# EAGLE design control_FET (EAGLE 6.5.0)
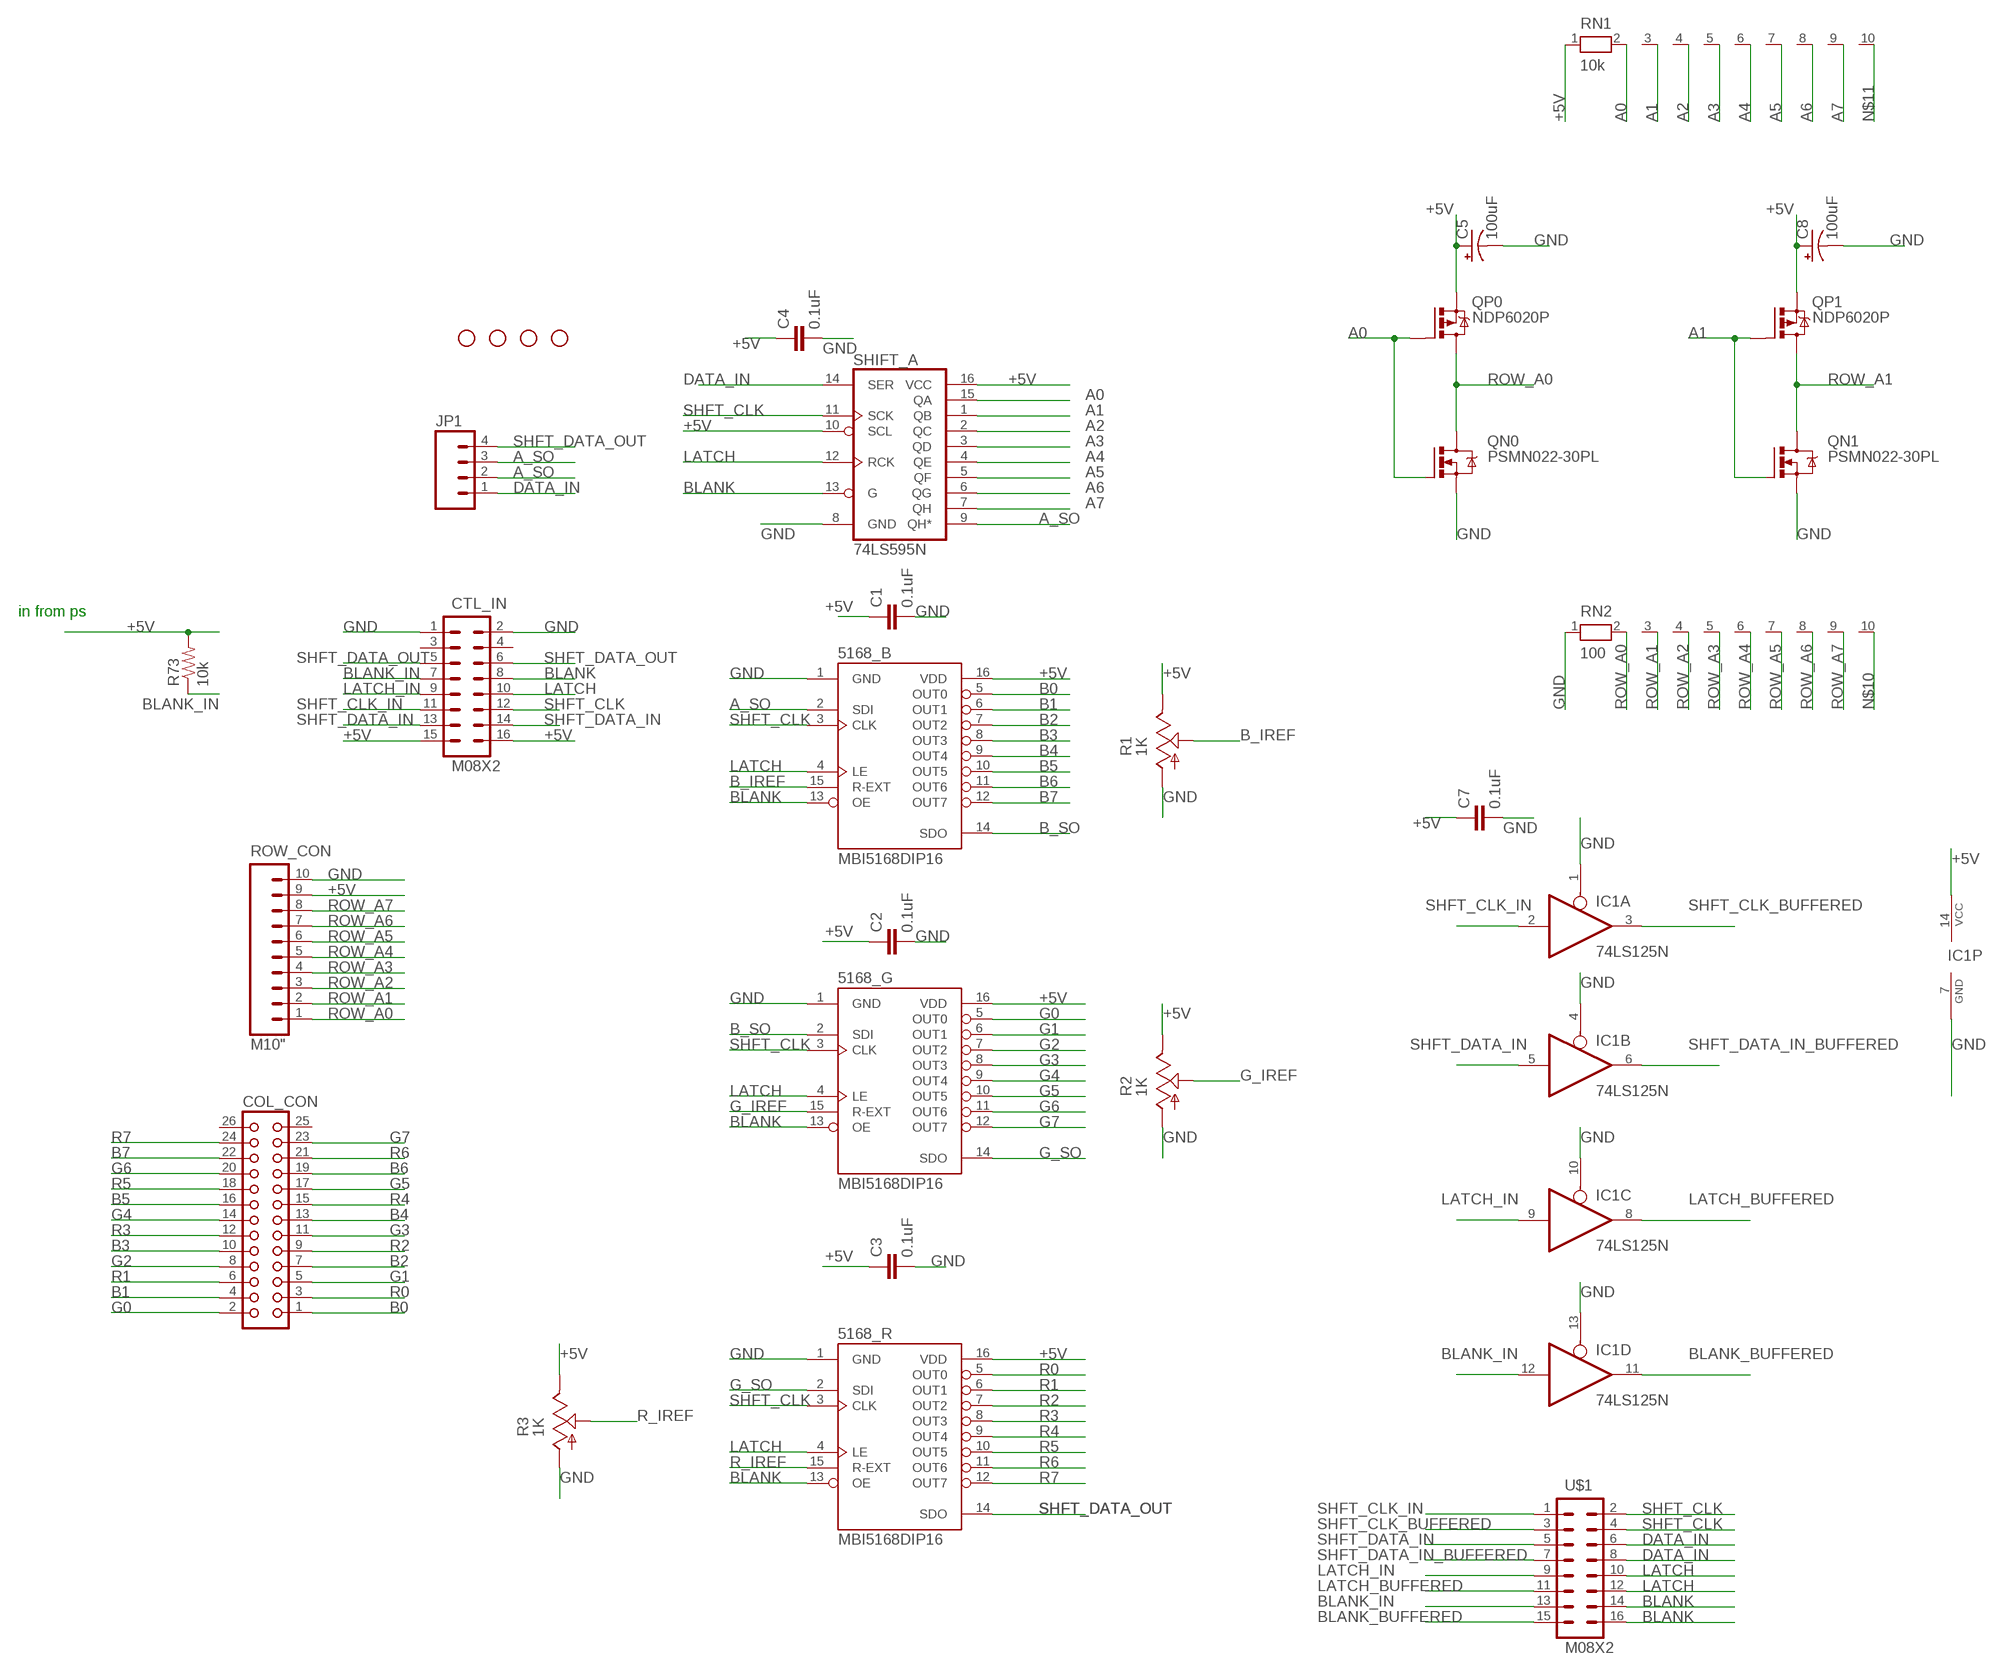
[diagram p0: schematic, sheet 1, part 1 of 2]
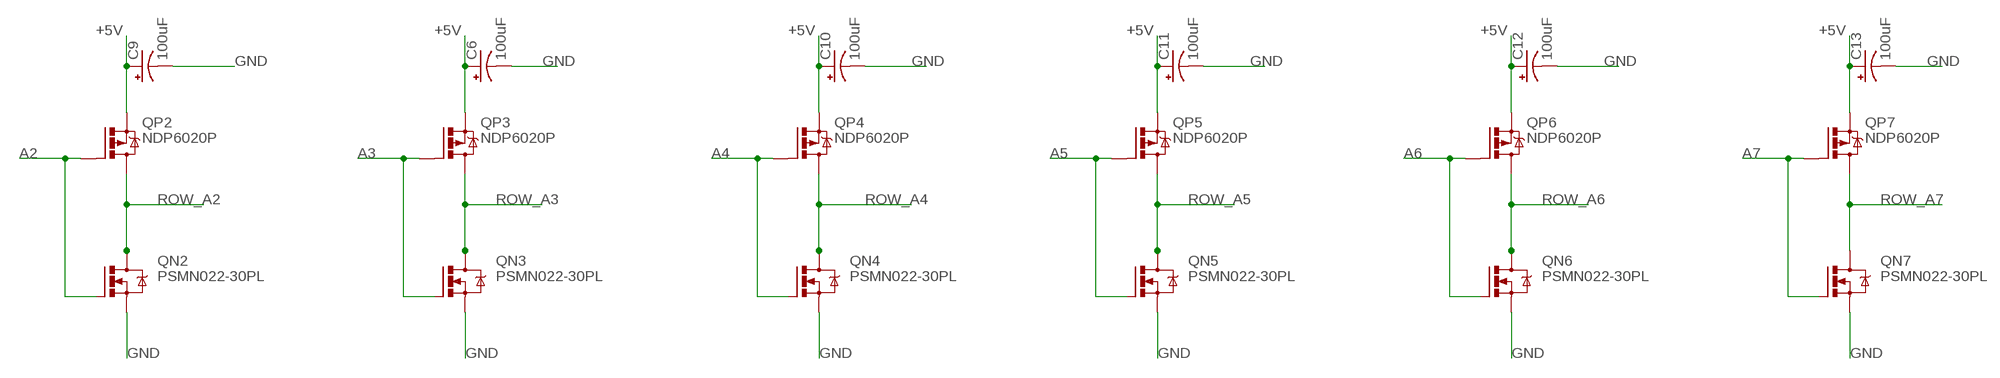
[diagram p1: schematic, sheet 1, part 2 of 2]

## Parts
5168_B  MBI5168DIP16  [DIL16]
5168_G  MBI5168DIP16  [DIL16]
5168_R  MBI5168DIP16  [DIL16]
C1  0.1uF  C2,5-3  [C2.5-3]
C2  0.1uF  C2,5-3  [C2.5-3]
C3  0.1uF  C2,5-3  [C2.5-3]
C4  0.1uF  C2,5-3  [C2.5-3]
C5  100uF  CAP_POLPTH1  [CPOL-RADIAL-100UF-25V]
C6  100uF  CAP_POLPTH1  [CPOL-RADIAL-100UF-25V]
C7  0.1uF  C2,5-3  [C2.5-3]
C8  100uF  CAP_POLPTH1  [CPOL-RADIAL-100UF-25V]
C9  100uF  CAP_POLPTH1  [CPOL-RADIAL-100UF-25V]
C10  100uF  CAP_POLPTH1  [CPOL-RADIAL-100UF-25V]
C11  100uF  CAP_POLPTH1  [CPOL-RADIAL-100UF-25V]
C12  100uF  CAP_POLPTH1  [CPOL-RADIAL-100UF-25V]
C13  100uF  CAP_POLPTH1  [CPOL-RADIAL-100UF-25V]
COL_CON  CON26  [CON26]
CTL_IN  M08X2  [2X8]
IC1  74LS125N  [DIL14]
JP1  M04PTH  [1X04]
QN0  PSMN022-30PL  IRF520  [TO220BV]
QN1  PSMN022-30PL  IRF520  [TO220BV]
QN2  PSMN022-30PL  IRF520  [TO220BV]
QN3  PSMN022-30PL  IRF520  [TO220BV]
QN4  PSMN022-30PL  IRF520  [TO220BV]
QN5  PSMN022-30PL  IRF520  [TO220BV]
QN6  PSMN022-30PL  IRF520  [TO220BV]
QN7  PSMN022-30PL  IRF520  [TO220BV]
QP0  NDP6020P  IRF9530  [TO220BV]
QP1  NDP6020P  IRF9530  [TO220BV]
QP2  NDP6020P  IRF9530  [TO220BV]
QP3  NDP6020P  IRF9530  [TO220BV]
QP4  NDP6020P  IRF9530  [TO220BV]
QP5  NDP6020P  IRF9530  [TO220BV]
QP6  NDP6020P  IRF9530  [TO220BV]
QP7  NDP6020P  IRF9530  [TO220BV]
R1  1K  TRIM_US-CA6V  [CA6V]
R2  1K  TRIM_US-CA6V  [CA6V]
R3  1K  TRIM_US-CA6V  [CA6V]
R73  10k  R-US_0207/10  [0207/10]
RN1  10k  RN09  [RN-10]
RN2  100  RN09  [RN-10]
ROW_CON  M10"  [1X10]
SHIFT_A  74LS595N  [DIL16]
STANDOFF1  STAND-OFF  [STAND-OFF]
STANDOFF2  STAND-OFF  [STAND-OFF]
STANDOFF3  STAND-OFF  [STAND-OFF]
STANDOFF4  STAND-OFF  [STAND-OFF]
U$1  M08X2  [2X8]

## Nets
+5V [pwr_gnd]: 5168_B.16(VDD) 5168_G.16(VDD) 5168_R.16(VDD) C1.1 C2.1 C3.1 C4.1 C5.1(+) C6.1(+) C7.1 C8.1(+) C9.1(+) C10.1(+) C11.1(+) C12.1(+) C13.1(+) CTL_IN.15 CTL_IN.16 IC1.14(P:VCC) QP0.S QP1.S QP2.S QP3.S QP4.S QP5.S QP6.S QP7.S R1.E R2.E R3.E R73.2 RN1.1 ROW_CON.9 SHIFT_A.10(SCL) SHIFT_A.16(VCC)
A0: QN0.G QP0.G RN1.2 SHIFT_A.15(QA)
A1: QN1.G QP1.G RN1.3 SHIFT_A.1(QB)
A2: QN2.G QP2.G RN1.4 SHIFT_A.2(QC)
A3: QN3.G QP3.G RN1.5 SHIFT_A.3(QD)
A4: QN4.G QP4.G RN1.6 SHIFT_A.4(QE)
A5: QN5.G QP5.G RN1.7 SHIFT_A.5(QF)
A6: QN6.G QP6.G RN1.8 SHIFT_A.6(QG)
A7: QN7.G QP7.G RN1.9 SHIFT_A.7(QH)
A_SO: 5168_B.2(SDI) JP1.2 JP1.3 SHIFT_A.9(QH*)
B0: 5168_B.5(OUT0) COL_CON.1
B1: 5168_B.6(OUT1) COL_CON.4
B2: 5168_B.7(OUT2) COL_CON.7
B3: 5168_B.8(OUT3) COL_CON.10
B4: 5168_B.9(OUT4) COL_CON.13
B5: 5168_B.10(OUT5) COL_CON.16
B6: 5168_B.11(OUT6) COL_CON.19
B7: 5168_B.12(OUT7) COL_CON.22
B_IREF: 5168_B.15(R-EXT) R1.S
B_SO: 5168_B.14(SDO) 5168_G.2(SDI)
BLANK: 5168_B.13(OE) 5168_G.13(OE) 5168_R.13(OE) CTL_IN.8 SHIFT_A.13(G) U$1.14 U$1.16
BLANK_BUFFERED: IC1.11(D:O) U$1.15
BLANK_IN: CTL_IN.7 IC1.12(D:I) R73.1 U$1.13
DATA_IN: JP1.1 SHIFT_A.14(SER) U$1.6 U$1.8
G0: 5168_G.5(OUT0) COL_CON.2
G1: 5168_G.6(OUT1) COL_CON.5
G2: 5168_G.7(OUT2) COL_CON.8
G3: 5168_G.8(OUT3) COL_CON.11
G4: 5168_G.9(OUT4) COL_CON.14
G5: 5168_G.10(OUT5) COL_CON.17
G6: 5168_G.11(OUT6) COL_CON.20
G7: 5168_G.12(OUT7) COL_CON.23
G_IREF: 5168_G.15(R-EXT) R2.S
G_SO: 5168_G.14(SDO) 5168_R.2(SDI)
GND [pwr_gnd]: 5168_B.1(GND) 5168_G.1(GND) 5168_R.1(GND) C1.2 C2.2 C3.2 C4.2 C5.2(-) C6.2(-) C7.2 C8.2(-) C9.2(-) C10.2(-) C11.2(-) C12.2(-) C13.2(-) CTL_IN.1 CTL_IN.2 IC1.1(A:OE) IC1.4(B:OE) IC1.7(P:GND) IC1.10(C:OE) IC1.13(D:OE) QN0.S QN1.S QN2.S QN3.S QN4.S QN5.S QN6.S QN7.S R1.A R2.A R3.A RN2.1 ROW_CON.10 SHIFT_A.8(GND)
LATCH: 5168_B.4(LE) 5168_G.4(LE) 5168_R.4(LE) CTL_IN.10 SHIFT_A.12(RCK) U$1.10 U$1.12
LATCH_BUFFERED: IC1.8(C:O) U$1.11
LATCH_IN: CTL_IN.9 IC1.9(C:I) U$1.9
N$10: RN2.10
N$11: RN1.10
R0: 5168_R.5(OUT0) COL_CON.3
R1: 5168_R.6(OUT1) COL_CON.6
R2: 5168_R.7(OUT2) COL_CON.9
R3: 5168_R.8(OUT3) COL_CON.12
R4: 5168_R.9(OUT4) COL_CON.15
R5: 5168_R.10(OUT5) COL_CON.18
R6: 5168_R.11(OUT6) COL_CON.21
R7: 5168_R.12(OUT7) COL_CON.24
R_IREF: 5168_R.15(R-EXT) R3.S
ROW_A0 [pwr_gnd]: QN0.D QP0.D RN2.2 ROW_CON.1
ROW_A1 [pwr_gnd]: QN1.D QP1.D RN2.3 ROW_CON.2
ROW_A2 [pwr_gnd]: QN2.D QP2.D RN2.4 ROW_CON.3
ROW_A3 [pwr_gnd]: QN3.D QP3.D RN2.5 ROW_CON.4
ROW_A4 [pwr_gnd]: QN4.D QP4.D RN2.6 ROW_CON.5
ROW_A5 [pwr_gnd]: QN5.D QP5.D RN2.7 ROW_CON.6
ROW_A6 [pwr_gnd]: QN6.D QP6.D RN2.8 ROW_CON.7
ROW_A7 [pwr_gnd]: QN7.D QP7.D RN2.9 ROW_CON.8
SHFT_CLK: 5168_B.3(CLK) 5168_G.3(CLK) 5168_R.3(CLK) CTL_IN.12 SHIFT_A.11(SCK) U$1.2 U$1.4
SHFT_CLK_BUFFERED: IC1.3(A:O) U$1.3
SHFT_CLK_IN: CTL_IN.11 IC1.2(A:I) U$1.1
SHFT_DATA_IN: CTL_IN.13 CTL_IN.14 IC1.5(B:I) U$1.5
SHFT_DATA_IN_BUFFERED: IC1.6(B:O) U$1.7
SHFT_DATA_OUT: 5168_R.14(SDO) CTL_IN.5 CTL_IN.6 JP1.4
Unconnected: COL_CON.25 COL_CON.26 CTL_IN.3 CTL_IN.4

## Notes on the sheet
- in from ps

## Library data of the parts
5168_B 5168_G 5168_R = MBI:MBI5168: MBI5168 8-bit constant current LED sink driver
C1-C4 C7 = capacitor-wima:C: CAPACITOR naming: grid - package width
C5 C6 C8-C13 = SparkFun-Capacitors:CAP_POL: Capacitor Polarized These are standard SMD and PTH capacitors. Normally 10uF, 47uF, and 100uF in electrolytic and tantalum varieties. Always verify the external diameter of the through hole cap, it varies with capacity, voltage, and manufacturer. The EIA devices should be standard.
COL_CON = con-harting:CON26: CONNECTOR; OC_FARNELL: unknown; OC_NEWARK: unknown
CTL_IN U$1 = SparkFun-Connectors:M08X2: .1" headers, two rows of 8 each
IC1 = 74xx-us:74*125: Quad bus BUFFER, 3-state
JP1 = SparkFun-Connectors:M04: Header 4 Standard 4-pin 0.1" header. Use with straight break away headers (SKU : PRT-00116), right angle break away headers (PRT-00553), swiss pins (PRT-00743), machine pins (PRT-00117), and female headers (PRT-00115). Molex polarized connector foot print use with SKU : PRT-08231 with associated crimp pins and housings. 1MM SMD Version SKU: PRT-10208
QN0 QN1-QN7 = transistor-power:IRF520: HEXFET Power MOSFET
QP0 QP1-QP7 = transistor-power:IRF9530: P-CHANNEL HEXFET POWER-MOS-FET Source: http://www.irf.com/product-info/datasheets/data/irf9530.pdf
R1-R3 = pot:TRIM_US-: POTENTIOMETER
R73 = resistor:R-US_: RESISTOR, American symbol
RN1 RN2 = resistor-net:RN09: RESISTOR NETWORK; OC_FARNELL: unknown; OC_NEWARK: unknown
ROW_CON = SparkFun-Connectors:M10: Header 10 Standard 10-pin 0.1" header. Use with straight break away headers (SKU : PRT-00116), right angle break away headers (PRT-00553), swiss pins (PRT-00743), machine pins (PRT-00117), and female headers (PRT-00115).
SHIFT_A = SparkFun-DigitalIC:74*595: 8-bit SHIFT REGISTER, output latch
STANDOFF1-STANDOFF4 = SparkFun-Electromechanical:STAND-OFF: #4 Stand Off This is the mechanical footprint for a #4 phillips button head screw. Use the keepout ring to avoid running the screw head into surrounding components. SKU : PRT-00447

## Net classes
1 pwr_gnd: width 0.813 mm

## Board
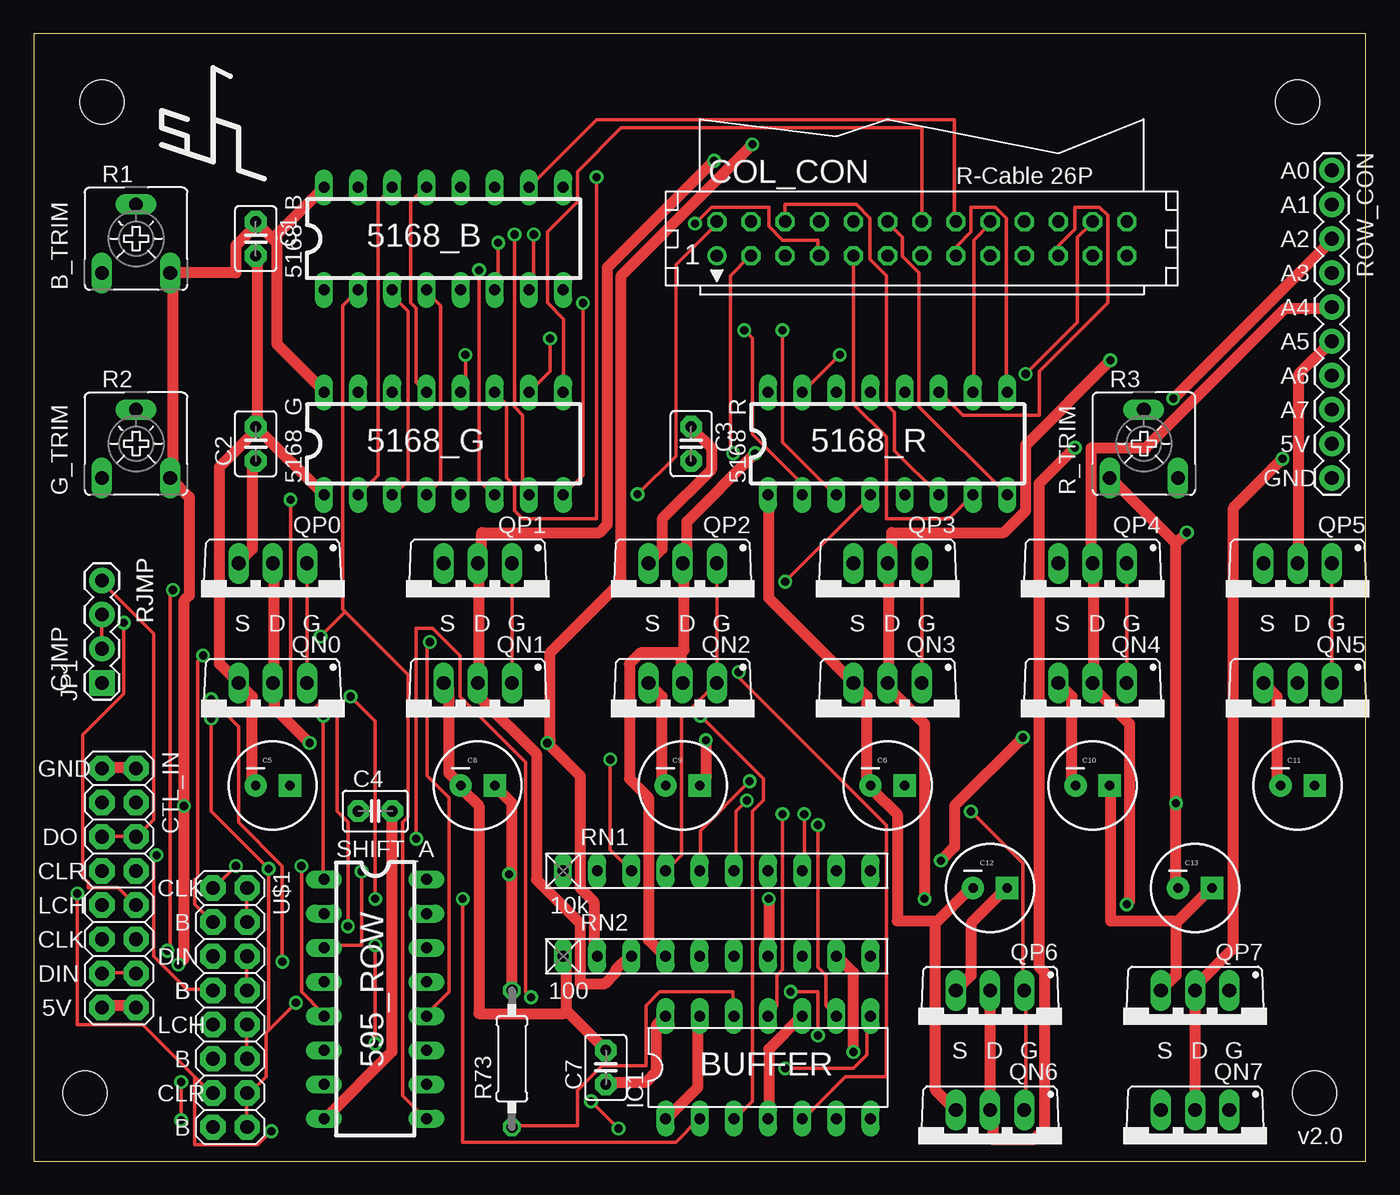
[diagram p2: board, top side]
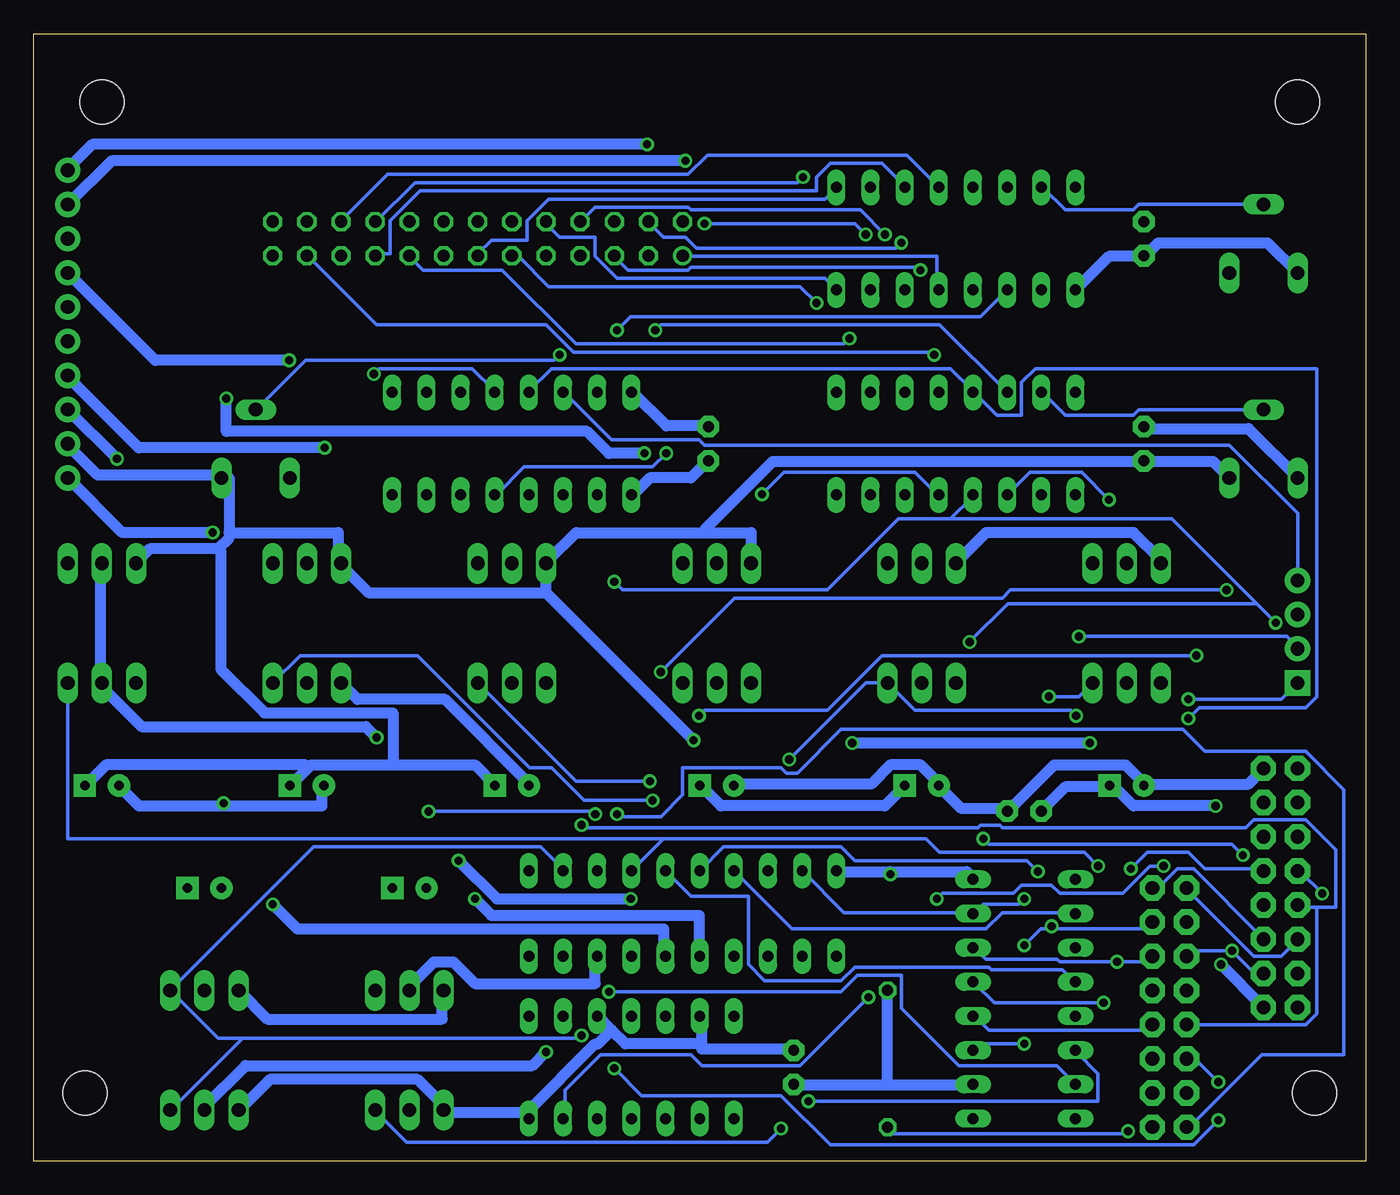
[diagram p3: board, bottom side, seen from below]

Size 99.06 x 83.82 mm. Coordinates in mm from the lower left corner, seen from the top.
Outline: 0,0 99.06,0 99.06,83.82 0,83.82 0,0
Copper layers (1*16): Top 0.035mm / dielectric 1.5mm / Bottom 0.035mm
Design rules "default": minimum track width 10mil, minimum drill 24mil, track to track 8mil, track to pad 8mil, pad to pad 8mil, via to via 8mil, smd to smd 8mil, copper to edge 40mil, drill to drill 8mil, minimum pad ring 10mil, minimum via ring 8mil, stop-mask expansion 4mil, vias tented up to drill 0mil, thermal gap 10mil

### Footprints (pad centres in the part's own frame; a part is rotated, then mirrored left to right if it is on the bottom)
DIL16 = drill 0.813 long: 1 -8.89,-3.81; 2 -6.35,-3.81; 3 -3.81,-3.81; 4 -1.27,-3.81; 5 1.27,-3.81; 6 3.81,-3.81; 7 6.35,-3.81; 8 8.89,-3.81; 9 8.89,3.81; 10 6.35,3.81; 11 3.81,3.81; 12 1.27,3.81; 13 -1.27,3.81; 14 -3.81,3.81; 15 -6.35,3.81; 16 -8.89,3.81
C2.5-3 = drill 0.813 pad 1.6 octagon: 1 -1.27,0; 2 1.27,0
CPOL-RADIAL-100UF-25V = drill 0.7 pad 1.651 square: 1 1.27,0 | drill 0.7 pad 1.651: 2 -1.27,0
CON26 = drill 0.914: 1 -15.24,-1.27 | drill 0.914 octagon: 2 -15.24,1.27; 3 -12.7,-1.27; 4 -12.7,1.27; 5 -10.16,-1.27; 6 -10.16,1.27; 7 -7.62,-1.27; 8 -7.62,1.27; 9 -5.08,-1.27; 10 -5.08,1.27; 11 -2.54,-1.27; 12 -2.54,1.27; 13 0,-1.27; 14 0,1.27; 15 2.54,-1.27; 16 2.54,1.27; 17 5.08,-1.27; 18 5.08,1.27; 19 7.62,-1.27; 20 7.62,1.27; 21 10.16,-1.27; 22 10.16,1.27; 23 12.7,-1.27; 24 12.7,1.27; 25 15.24,-1.27; 26 15.24,1.27
2X8 = drill 1.016 pad 1.88 octagon: 1 0,0; 2 0,2.54; 3 2.54,0; 4 2.54,2.54; 5 5.08,0; 6 5.08,2.54; 7 7.62,0; 8 7.62,2.54; 9 10.16,0; 10 10.16,2.54; 11 12.7,0; 12 12.7,2.54; 13 15.24,0; 14 15.24,2.54; 15 17.78,0; 16 17.78,2.54
DIL14 = drill 0.813 long: 1 -7.62,-3.81; 2 -5.08,-3.81; 3 -2.54,-3.81; 4 0,-3.81; 5 2.54,-3.81; 6 5.08,-3.81; 7 7.62,-3.81; 8 7.62,3.81; 9 5.08,3.81; 10 2.54,3.81; 11 0,3.81; 12 -2.54,3.81; 13 -5.08,3.81; 14 -7.62,3.81
1X04 = drill 1.016 pad 1.88 square: 1 0,0 | drill 1.016 pad 1.88: 2 2.54,0; 3 5.08,0; 4 7.62,0
TO220BV = drill 1.016 long: D 0,-2.54; G -2.54,-2.54; S 2.54,-2.54
CA6V = drill 1.016 long: A -2.54,-2.54; E 2.54,-2.54; S 0,2.54
0207/10 = drill 0.813 octagon: 1 -5.08,0; 2 5.08,0
RN-10 = drill 0.813 long: 1 -11.43,0; 2 -8.89,0; 3 -6.35,0; 4 -3.81,0; 5 -1.27,0; 6 1.27,0; 7 3.81,0; 8 6.35,0; 9 8.89,0; 10 11.43,0
1X10 = drill 1.016 pad 1.88: 1 0,0; 2 2.54,0; 3 5.08,0; 4 7.62,0; 5 10.16,0; 6 12.7,0; 7 15.24,0; 8 17.78,0; 9 20.32,0; 10 22.86,0
STAND-OFF = hole 3.302: 0,0

### Placement (x,y rotation side)
5168_B  30.48,68.58 0 top
5168_G  30.48,53.34 0 top
5168_R  63.5,53.34 0 top
C1  16.51,68.58 270 top
C2  16.51,53.34 90 top
C3  48.9,53.34 270 top
C4  25.4,26.04 0 top
C5  17.78,27.94 0 top
C6  63.5,27.94 0 top
C7  42.55,6.99 90 top
C8  33.02,27.94 0 top
C9  48.26,27.94 0 top
C10  78.74,27.94 0 top
C11  93.98,27.94 0 top
C12  71.12,20.32 0 top
C13  86.36,20.32 0 top
COL_CON  66.04,68.58 0 top
CTL_IN  5.08,29.21 270 top
IC1  54.61,6.99 0 top
JP1  5.08,35.56 90 top
QN0  17.78,33.02 180 top
QN1  33.02,33.02 180 top
QN2  48.26,33.02 180 top
QN3  63.5,33.02 180 top
QN4  78.74,33.02 180 top
QN5  93.98,33.02 180 top
QN6  71.12,1.27 180 top
QN7  86.36,1.27 180 top
QP0  17.78,41.91 180 top
QP1  33.02,41.91 180 top
QP2  48.26,41.91 180 top
QP3  63.5,41.91 180 top
QP4  78.74,41.91 180 top
QP5  93.98,41.91 180 top
QP6  71.12,10.16 180 top
QP7  86.36,10.16 180 top
R1  7.62,68.58 0 top
R2  7.62,53.34 0 top
R3  82.55,53.34 0 top
R73  35.56,7.62 90 top
RN1  50.8,21.59 0 top
RN2  50.8,15.24 0 top
ROW_CON  96.52,73.66 270 top
SHIFT_A  25.4,12.06 270 top
STANDOFF1  95.25,5.08 0 top
STANDOFF2  93.98,78.74 0 top
STANDOFF3  3.81,5.08 0 top
STANDOFF4  5.08,78.74 0 top
U$1  13.34,20.32 270 top

### Tracks (layer width: path | path; a pad name or v marks a point on that pad's centre or on a via)
+5V  (via drill 0.61)
  Top 0.813: 17.88,68.48 C1.1 16.46,69.49 15.04,68.07 15.04,66.04 R1.E 10.36,65.84 10.36,51 R2.E 11.58,49.38 11.58,42.06 11.18,41.66 v11.18,26.42 11.18,15.04 v10.77,14.63 | 17.88,68.48 18.09,68.28 18.09,60.76 21.54,57.3 5168_G.16 | 5168_B.16 18.09,68.89 18.09,68.68 17.88,68.48 | CTL_IN.15 5.08,11.58 7.52,11.58 CTL_IN.16 | C2.1 16.26,51.82 16.26,45.52 15.24,44.5 QP0.S | QP6.S 69.7,13.82 69.7,17.68 72.34,20.32 C12.1 | QP7.S 84.94,13.82 84.94,17.68 | 84.94,17.68 87.58,20.32 C13.1 | 84.94,17.68 84.73,17.88 80.06,17.88 80.06,27.84 C10.1 | IC1.14 46.94,10.77 46.33,10.16 46.33,6.71 45.52,5.89 42.67,5.89 C7.1 | R73.2 35.56,21.34 | 35.56,21.34 35.56,26.62 34.34,27.84 C8.1 | v35.36,21.34 35.56,21.34 | QP2.S 45.72,44.5 46.74,45.52 46.74,47.75 50.39,51.41 50.39,53.03 48.97,54.46 C3.1 | v49.99,31.29 49.99,28.45 49.58,28.04 C9.1
  Bottom 0.813: C4.1 23.98,26.21 22.35,27.84 19.1,27.84 C5.1 18.69,27.84 17.27,26.42 v11.18,26.42 | QP0.S 15.24,44.7 17.27,46.74 28.25,46.74 30.48,44.5 QP1.S | R2.E 11.38,52.02 16.46,52.02 C2.1 16.87,52.02 44.09,52.02 49.17,46.94 49.17,46.74 | v10.77,14.63 7.72,11.58 CTL_IN.16 | QP7.S 81.69,10.57 68.68,10.57 68.68,12.6 QP6.S | 72.34,29.46 78.44,29.46 78.64,29.26 | 72.34,29.46 66.24,29.46 64.82,28.04 C6.1 | 78.64,29.26 79.86,28.04 C10.1 | C11.1 95.1,28.04 93.67,29.46 78.84,29.46 78.64,29.26 | 35.36,21.54 39.22,21.54 RN1.1 | 35.36,21.54 29.67,21.54 29.26,21.13 SHIFT_A.16 | 35.56,5.69 42.47,5.69 C7.1 | 35.56,5.69 29.26,5.69 SHIFT_A.10 | 35.56,5.69 R73.2 | C9.1 49.38,27.84 47.95,26.42 35.76,26.42 34.34,27.84 C8.1 | v35.36,21.34 35.36,21.54 | 5168_R.16 54.46,57.1 52.02,54.66 48.97,54.66 C3.1 | 60.96,42.27 QP3.S 60.76,44.7 58.73,46.74 49.17,46.74 | 60.96,42.27 74.17,42.27 76.2,44.3 QP4.S 76.4,44.7 76.4,46.74 84.53,46.74 | 85.34,45.52 90.42,45.52 91.44,44.5 QP5.S | 85.34,45.52 84.53,46.33 84.53,46.74 | 84.53,46.74 84.53,50.8 R3.E 85.34,51 94.28,51 96.52,53.24 ROW_CON.9 | QP2.S 45.72,46.74 49.17,46.74 | 60.96,42.27 v49.99,31.29 | 72.34,29.46 72.34,33.33 81.89,33.33 85.14,36.58 85.14,45.31 85.34,45.52
A0  (via drill 0.61)
  Top 0.254: QP0.G QN0.G | v23.57,34.54 25.4,32.72 v25.4,19.51
  Bottom 0.254: RN1.2 38.81,18.49 29.26,18.49 SHIFT_A.15 29.06,18.49 28.45,19.1 25.81,19.1 v25.4,19.51 | QN0.G 21.34,34.54 v23.57,34.54
A1  (via drill 0.61)
  Top 0.254: v21.54,33.12 21.54,21.13 SHIFT_A.1 | RN1.3 42.88,23.16 v42.88,29.87 | QN1.G QP1.G
  Bottom 0.254: v21.54,33.12 21.95,33.53 33.53,33.53 QN1.G 37.19,35.56 v42.88,29.87
A2
  Top 0.254: QP2.G QN2.G 48.16,32.92 48.16,22.76 RN1.4
  Bottom 0.254: RN1.4 42.67,17.27 28.25,17.27 27.03,18.49 21.74,18.49 SHIFT_A.2
A3  (via drill 0.61)
  Top 0.254: QP3.G QN3.G | v24.38,21.54 24.38,16.05 21.74,16.05 SHIFT_A.3 | v53.24,28.25 49.58,24.59 49.58,21.74 RN1.5
  Bottom 0.254: v24.38,21.54 25.2,22.35 38,22.35 39.01,23.37 47.75,23.37 RN1.5 | QN3.G 58.73,28.25 v53.24,28.25
A4  (via drill 0.61)
  Top 0.254: QP4.G QN4.G | v53.03,26.82 52.22,26.01 52.22,21.74 RN1.6
  Bottom 0.254: RN1.6 50.19,19.71 45.92,19.71 45.92,14.63 44.7,13.41 39.01,13.41 38,14.43 28.04,14.43 27.84,14.22 22.55,14.22 21.74,13.41 SHIFT_A.4 | QN4.G 79.25,37.59 70.51,37.59 62.18,29.26 60.55,29.26 58.12,26.82 v53.03,26.82
A5  (via drill 0.61)
  Top 0.254: QP5.G QN5.G | v19.91,21.95 19.91,12.6 21.54,10.97 SHIFT_A.5
  Bottom 0.254: v19.91,21.95 20.93,22.96 31.7,22.96 32.72,23.98 52.22,23.98 | RN1.7 52.22,23.98 | QN5.G 96.52,23.98 52.22,23.98
A6  (via drill 0.61)
  Top 0.254: v57.3,25.81 57.3,21.74 RN1.8 | v69.7,26.01 73.56,22.15 73.56,12.8 QP6.G 73.76,12.6 73.76,3.86 QN6.G | v43.48,2.44 v41.45,4.47
  Bottom 0.254: v57.3,25.81 57.51,26.01 v69.7,26.01 | v41.45,4.47 19.91,4.47 19.91,6.5 21.54,8.13 SHIFT_A.6 | v43.48,2.44 44.5,1.42 71.32,1.42 73.56,3.66 QN6.G
A7  (via drill 0.61)
  Top 0.254: v56.29,12.6 58.32,12.6 v58.32,9.35
  Bottom 0.254: v56.29,12.6 39.01,12.6 37.8,13.82 34.54,13.82 34.54,11.38 30.28,7.11 22.96,7.11 21.74,5.89 SHIFT_A.7 | v58.32,9.35 58.52,9.14 83.52,9.14 | 83.52,9.14 85.34,9.14 QP7.G 78.23,23.37 61.37,23.37 59.74,21.74 RN1.9 | 83.52,9.14 88.8,3.86 QN7.G
A_SO  (via drill 0.61)
  Top 0.254: JP1.3 JP1.2 | 23.16,40.84 22.96,41.05 22.96,63.6 5168_B.2 | 23.16,40.84 27.84,36.17 27.84,25.6 27.43,25.2 27.43,4.88 29.06,3.25 SHIFT_A.9 | 23.16,40.84 v21.34,39.01
  Bottom 0.254: v21.34,39.01 5.89,39.01 5.08,38.2 JP1.2
B0
  Bottom 0.254: 5168_B.5 31.9,64.82 31.9,67.26 50.8,67.26 COL_CON.1
B1  (via drill 0.61)
  Top 0.254: 5168_B.6 34.54,65.02 v34.54,68.28
  Bottom 0.254: v34.54,68.28 34.95,67.87 49.78,67.87 50.6,68.68 52.22,68.68 53.24,69.7 COL_CON.4
B2  (via drill 0.61)
  Top 0.254: v37.19,68.89 37.19,65.02 36.98,64.82 5168_B.7 | v49.17,69.7 50.39,70.92 54.66,70.92 54.66,69.49 55.68,68.48 58.32,68.48 58.32,67.46 COL_CON.7
  Bottom 0.254: v37.19,68.89 38,69.7 v49.17,69.7
B3
  Bottom 0.254: 5168_B.8 40.23,65.63 55.68,65.63 57.3,67.26 57.3,68.68 59.94,68.68 60.96,69.7 COL_CON.10
B4
  Bottom 0.254: 5168_B.9 40.23,71.53 60.76,71.53 62.38,69.9 62.38,68.48 65.02,68.48 66.04,67.46 COL_CON.13
B5
  Top 0.254: 5168_B.10 41.86,77.42 68.48,77.42 68.48,69.9 COL_CON.16
B6
  Bottom 0.254: 5168_B.11 34.34,72.54 35.97,74.17 39.83,74.17 40.84,73.15 40.84,72.14 70.31,72.14 72.54,69.9 72.54,67.46 73.56,67.46 COL_CON.19
B7
  Bottom 0.254: 5168_B.12 34.14,74.78 48.97,74.78 50.39,73.36 72.75,73.36 76.2,69.9 COL_CON.22
B_IREF
  Bottom 0.254: R1.S 16.87,71.12 17.27,70.71 22.35,70.71 23.98,72.34 5168_B.15
B_SO
  Top 0.254: 5168_G.2 25.6,51 25.6,71.32 5168_B.14
BLANK  (via drill 0.61)
  Top 0.254: 17.48,9.75 17.27,9.55 17.27,6.3 16.05,5.08 U$1.14 15.85,5.08 15.85,2.64 U$1.16 | 17.48,9.75 v19.51,11.79 | 17.48,9.75 v17.48,21.74 13.21,26.01 v13.21,32.92 | 5168_G.13 28.45,57.91 28.45,63.4 28.04,63.8 28.04,71.32 29.06,72.34 5168_B.13
  Bottom 0.254: v19.51,11.79 27.64,11.79 29.06,13.21 SHIFT_A.13 | v17.48,21.74 16.26,22.96 13.21,22.96 11.99,21.74 7.72,21.74 CTL_IN.8 | 5168_R.13 62.18,57.3 60.55,58.93 30.89,58.93 29.26,57.3 5168_G.13 29.06,57.1 27.43,55.47 25.6,55.47 25.6,57.91 24.59,58.93 3.66,58.93 3.66,34.54 4.47,33.73 12.39,33.73 v13.21,32.92
BLANK_BUFFERED  (via drill 0.61)
  Top 0.254: v55.68,25.81 55.68,14.22 55.27,13.82 55.27,11.58 54.66,10.97 IC1.11
  Bottom 0.254: v55.68,25.81 55.47,25.6 52.43,25.6 50.8,27.23 50.8,29.26 43.48,29.26 43.08,28.85 42.27,28.85 39.01,32.11 13.61,32.11 11.99,30.48 4.47,30.48 1.63,27.64 1.63,7.92 7.72,7.92 13.01,2.64 13.21,2.64 U$1.15
BLANK_IN  (via drill 0.61)
  Top 0.254: R73.1 35.56,2.64 40.44,2.64 40.44,5.28 42.27,7.11 45.52,7.11 45.52,11.58 46.53,12.6 52.02,12.6 52.02,10.97 IC1.12 | 11.99,6.3 8.13,10.16 3.25,10.16 v3.25,19.91 | 11.99,6.3 13.21,5.08 U$1.13 | v17.68,2.23 16.66,1.22 11.99,1.22 11.99,6.3
  Bottom 0.254: v3.25,19.91 4.88,21.54 5.08,21.54 CTL_IN.7 | v17.68,2.23 17.88,2.03 35.15,2.03 35.56,2.44 R73.1
DATA_IN  (via drill 0.61)
  Top 0.254: v13.21,34.34 15.24,32.31 15.24,25.2 18.49,21.95 v18.49,14.83 | U$1.8 15.85,12.8 15.85,15.24 U$1.6
  Bottom 0.254: SHIFT_A.14 29.06,15.85 28.25,15.04 22.96,15.04 22.76,14.83 v18.49,14.83 16.46,14.83 16.05,15.24 U$1.6 | JP1.1 6.3,34.34 v13.21,34.34
G0  (via drill 0.61)
  Top 0.254: v44.91,49.58 47.75,52.43 47.75,66.65 50.8,69.7 COL_CON.2
  Bottom 0.254: v44.91,49.58 43.28,51.21 33.53,51.21 31.9,49.58 5168_G.5
G1  (via drill 0.61)
  Top 0.254: v33.12,66.24 33.12,50.6 34.14,49.58 5168_G.6
  Bottom 0.254: v33.12,66.24 33.33,66.45 50.19,66.45 50.39,66.24 54.86,66.24 55.88,67.26 COL_CON.5
G2  (via drill 0.61)
  Top 0.254: 5168_G.7 36.37,49.99 36.37,55.47 35.76,56.08 v35.76,68.89
  Bottom 0.254: v35.76,68.89 37.59,70.71 50.19,70.71 50.39,70.92 57.3,70.92 58.32,69.9 COL_CON.8
G3  (via drill 0.61)
  Top 0.254: 5168_G.8 40.84,51 v40.84,63.8
  Bottom 0.254: v40.84,63.8 42.06,65.02 60.76,65.02 62.99,67.26 63.4,67.26 COL_CON.11
G4
  Top 0.254: COL_CON.14 66.04,76.81 43.69,76.81 40.44,73.56 40.44,71.32 38.2,69.09 38.2,63.8 39.42,62.59 39.42,57.3 5168_G.9
G5  (via drill 0.61)
  Top 0.254: 5168_G.10 38.41,58.73 v38.41,61.16
  Bottom 0.254: v38.41,61.16 38.81,60.76 58.73,60.76 64.21,66.24 70.1,66.24 71.12,67.26 COL_CON.17
G6  (via drill 0.61)
  Top 0.254: 5168_G.11 35.15,56.29 35.15,50.8 35.76,50.19 35.76,48.36 36.37,47.75 41.86,47.75 v41.86,73.15
  Bottom 0.254: v41.86,73.15 42.27,72.75 70.71,72.75 73.56,69.9 COL_CON.20
G7  (via drill 0.61)
  Top 0.254: 5168_G.12 32.11,57.51 v32.11,59.94
  Bottom 0.254: v32.11,59.94 32.31,60.15 58.93,60.15 60.96,62.18 73.56,62.18 78.64,67.26 COL_CON.23
G_IREF
  Bottom 0.254: R2.S 16.87,55.88 17.27,55.47 22.35,55.47 23.98,57.1 5168_G.15
G_SO  (via drill 0.61)
  Top 0.254: v52.83,61.77 53.44,61.16 53.44,54.05 57.1,50.39 57.1,49.58 5168_R.2
  Bottom 0.254: 5168_G.14 31.7,62.18 52.43,62.18 v52.83,61.77
GND  (via drill 0.61)
  Top 0.813: IC1.4 54.66,3.25 54.66,8.33 57.1,10.77 IC1.10 | IC1.1 47.14,3.25 49.38,5.49 49.38,10.77 IC1.13 | 39.62,11.18 39.62,15.04 39.42,15.24 RN2.1 | C7.2 39.62,11.18 | 67.06,17.68 69.7,20.32 C12.2 | 67.06,17.68 67.06,5.28 68.48,3.86 QN6.S | 84.94,45.92 80.06,50.8 R3.A | 84.94,45.92 v84.94,26.62 84.94,20.32 C13.2 | 84.94,45.92 v85.75,46.74 | QN4.S 77.22,34.54 77.22,28.25 77.42,28.04 C10.2 | QN5.S 92.46,34.54 92.46,28.25 92.66,28.04 C11.2 | 54.66,49.58 5168_R.1 54.66,49.17 54.66,41.86 QN3.S 61.98,34.54 61.98,28.25 62.18,28.04 C6.2 62.38,27.64 64.21,25.81 64.21,17.88 66.85,17.88 67.06,17.68 | C2.2 5168_G.1 | C1.2 16.66,67.26 16.66,54.86 C2.2 | CTL_IN.1 5.08,29.26 7.52,29.26 CTL_IN.2 | C5.2 16.46,28.04 16.26,28.25 16.26,34.54 QN0.S 13.82,36.98 13.82,51.61 16.46,54.25 C2.2 | QN2.S 46.74,34.54 46.74,28.25 46.94,28.04 C9.2 | QN1.S 30.89,35.15 30.89,28.85 31.7,28.04 C8.2 31.9,27.64 33.12,26.42 33.12,10.97 39.42,10.97 39.62,11.18 | SHIFT_A.8 21.74,3.25 26.62,8.13 26.62,26.01 C4.2
  Bottom 0.813: 49.38,8.74 49.38,8.33 42.67,8.33 C7.2 | 49.38,8.74 49.38,10.77 IC1.13 | 56.08,9.75 55.07,8.74 49.38,8.74 | 56.08,9.75 57.1,10.77 IC1.10 | QN7.S 83.72,3.86 81.48,6.1 70.51,6.1 68.48,4.06 QN6.S 68.48,3.66 62.79,3.66 62.38,3.25 IC1.7 62.38,3.66 57.3,8.74 57.1,8.74 56.08,9.75 | ROW_CON.10 92.46,46.74 v85.75,46.74 | 84.94,26.42 91.24,26.42 92.66,27.84 C11.2 | 84.94,26.42 77.62,26.42 77.62,27.84 C10.2 | 5168_R.1 54.46,49.58 53.24,50.8 50.19,50.8 48.97,52.02 C3.2 | QN4.S 74.98,34.34 68.48,34.34 62.18,28.04 C6.2 | v84.94,26.62 84.94,26.42 | 5168_B.1 19.1,67.26 16.66,67.26 C1.2 16.26,67.46 15.44,68.28 7.32,68.28 R1.A | R2.A 8.74,54.46 16.46,54.46 C2.2 | CTL_IN.2 7.72,29.06 8.74,28.04 16.46,28.04 C5.2 16.66,28.25 17.88,29.46 23.16,29.46 26.42,26.21 C4.2 26.82,26.21 30.07,26.21 31.7,27.84 C8.2 31.9,28.25 33.12,29.46 35.36,29.46 36.78,28.04 46.94,28.04 C9.2
LATCH  (via drill 0.61)
  Top 0.254: U$1.12 15.85,7.72 15.85,10.16 U$1.10 | 5168_G.4 30.28,50.6 30.28,63.6 29.26,64.62 5168_B.4 | v55.88,43.08 62.18,49.38 5168_R.4 | v6.71,40.03 6.71,34.75 3.66,31.7 3.66,21.13 4.06,20.73 4.06,20.32 6.3,20.32 7.52,19.1 CTL_IN.10 | v29.46,38.61 29.26,38.41 29.26,28.65 30.89,27.03 30.89,12.6 29.26,10.97 SHIFT_A.12
  Bottom 0.254: SHIFT_A.12 29.06,10.77 28.04,9.75 16.46,9.75 16.05,10.16 U$1.10 | v55.88,43.08 55.27,42.47 40.03,42.47 34.75,47.75 30.89,47.75 | 30.89,47.75 29.26,49.38 5168_G.4 | 8.13,41.45 14.43,47.75 30.89,47.75 | 8.13,41.45 v6.71,40.03 | v29.46,38.61 26.62,41.45 8.13,41.45
LATCH_BUFFERED  (via drill 0.61)
  Top 0.254: v55.88,6.91 60.96,6.91 61.98,7.92 61.98,10.57 62.18,10.77 IC1.8 | v10.97,5.89 v10.97,3.05
  Bottom 0.254: v55.88,6.91 53.85,4.88 43.48,4.88 39.83,1.22 12.8,1.22 v10.97,3.05 | v10.97,5.89 12.6,7.52 13.21,7.52 U$1.11
LATCH_IN  (via drill 0.61)
  Top 0.254: v58.32,24.99 58.32,14.43 58.93,13.82 58.93,11.58 59.54,10.97 IC1.9
  Bottom 0.254: v58.32,24.99 58.12,24.79 28.85,24.79 28.65,24.99 27.23,24.99 27.03,24.79 8.94,24.79 8.33,25.4 4.47,25.4 2.23,23.16 2.23,18.9 3.66,18.9 | 3.66,18.9 5.08,18.9 CTL_IN.9 | U$1.9 4.47,10.16 3.66,10.97 3.66,18.9
R0  (via drill 0.61)
  Top 0.254: v52.02,52.63 51.82,52.83 51.82,65.84 53.24,67.26 COL_CON.3
  Bottom 0.254: v52.02,52.63 53.03,51.61 62.59,51.61 64.62,49.58 5168_R.5
R1
  Top 0.254: 5168_R.6 64.01,52.83 64.01,55.68 63.4,56.29 63.4,65.84 62.18,67.06 62.18,70.1 61.16,71.12 55.88,71.12 COL_CON.6
R2
  Top 0.254: 5168_R.7 68.07,47.75 63.4,47.75 63.4,53.85 60.96,56.29 COL_CON.9
R3
  Top 0.254: 5168_R.8 65.84,56.08 65.84,66.04 64.62,67.26 64.62,68.68 63.6,69.7 COL_CON.12
R4
  Top 0.254: 5168_R.9 72.34,57.3 72.34,70.1 71.53,70.92 69.7,70.92 69.7,69.09 68.68,68.07 68.68,67.46 COL_CON.15
R5
  Top 0.254: 5168_R.10 69.9,57.3 69.9,68.48 71.12,69.7 COL_CON.18
R6
  Top 0.254: COL_CON.21 76.2,68.07 77.42,69.29 77.42,70.92 79.25,70.92 79.86,70.31 79.86,63.8 74.78,58.73 74.78,55.47 69.09,55.47 67.46,57.1 5168_R.11
R7  (via drill 0.61)
  Top 0.254: v73.76,58.52 77.62,62.38 77.62,68.68 78.64,69.7 COL_CON.24
  Bottom 0.254: v73.76,58.52 73.36,58.93 66.45,58.93 64.82,57.3 5168_R.12
R_IREF  (via drill 0.61)
  Top 0.254: v59.94,59.94 5168_R.15
  Bottom 0.254: v59.94,59.94 60.35,59.54 78.84,59.54 82.5,55.88 R3.S
ROW_A0  (via drill 0.61)
  Top 0.813: v20.52,31.09 17.88,33.73 17.88,35.56 QN0.D 17.88,35.76 17.88,44.3 QP0.D | RN2.2 41.86,15.24 41.66,15.44 41.66,19.3 40.64,20.32 40.64,28.65 v38.2,31.09 38.41,31.29 38.41,37.8 43.69,43.08 43.69,65.84 v53.44,75.59
  Bottom 0.813: v20.52,31.09 v38.2,31.09 | v53.44,75.59 94.69,75.59 96.52,73.76 ROW_CON.1
ROW_A1  (via drill 0.61)
  Top 0.813: RN2.3 44.3,15.24 43.28,14.22 43.28,14.02 42.47,13.21 40.64,13.21 40.64,17.68 37.39,20.93 37.39,30.28 33.12,34.54 33.12,35.56 QN1.D 33.12,35.76 33.12,44.3 QP1.D 33.33,44.7 33.33,46.74 42.06,46.74 42.67,47.35 42.67,66.45 v50.6,74.37
  Bottom 0.813: ROW_CON.2 93.27,74.37 v50.6,74.37
ROW_A2  (via drill 0.61)
  Top 0.813: 48.16,37.8 45.11,37.8 44.3,36.98 44.3,28.45 45.72,27.03 45.72,16.46 46.94,15.24 RN2.4 | 48.16,37.8 48.16,35.56 QN2.D | 48.16,37.8 48.36,38 48.36,44.3 QP2.D 48.56,44.7 48.56,47.55 v53.65,52.63 | v84.73,56.69 96.52,68.48 ROW_CON.3
  Bottom 0.813: v84.73,56.69 84.73,54.25 57.91,54.25 56.29,52.63 v53.65,52.63
ROW_A3  (via drill 0.61)
  Top 0.813: v66.24,19.51 66.24,32.51 63.6,35.15 63.6,35.56 QN3.D 63.6,35.76 63.6,44.3 QP3.D 63.8,44.7 63.8,46.74 72.14,46.74 73.76,48.36 73.76,53.24 v80.06,59.54
  Bottom 0.813: v66.24,19.51 65.02,18.29 49.58,18.29 49.58,15.24 RN2.5 | ROW_CON.4 90.02,59.54 v80.06,59.54
ROW_A4  (via drill 0.61)
  Top 0.813: v81.28,19.1 81.48,19.3 81.48,32.51 78.84,35.15 78.84,35.56 QN4.D 78.84,35.76 78.84,44.3 QP4.D 78.64,44.7 78.64,53.03 82.7,53.03 93.07,63.4 96.52,63.4 ROW_CON.5
  Bottom 0.813: v81.28,19.1 79.45,17.27 52.22,17.27 52.22,15.24 RN2.6
ROW_A5  (via drill 0.61)
  Top 0.813: v54.66,19.51 54.66,15.24 RN2.7 | v67.46,22.35 68.48,23.37 68.48,26.42 v73.56,31.5 | ROW_CON.6 94.08,58.52 94.08,44.5 QP5.D
  Bottom 0.813: v54.66,19.51 64.62,19.51 v67.46,22.35 | v73.56,31.5 74.37,32.31 91.03,32.31 93.88,35.15 93.88,35.56 QN5.D 94.08,35.76 94.08,44.3 QP5.D
ROW_A6  (via drill 0.61)
  Top 0.813: QP6.D QN6.D 71.32,3.45 71.32,1.63 74.37,1.63 75.18,2.44 75.18,14.02 74.78,14.43 74.78,50.39 v77.42,53.03
  Bottom 0.813: QP6.D 71.12,13.01 69.29,14.83 67.87,14.83 66.24,13.21 57.3,13.21 57.3,15.24 RN2.8 | v77.42,53.03 91.24,53.03 96.52,58.32 ROW_CON.7
ROW_A7  (via drill 0.61)
  Top 0.813: v60.96,8.13 60.96,14.02 59.74,15.24 RN2.9 | QN7.D QP7.D 86.56,13.01 86.56,13.21 89.2,15.85 89.2,48.56 v92.86,52.22
  Bottom 0.813: v60.96,8.13 61.98,7.11 83.31,7.11 86.36,4.06 QN7.D | v92.86,52.22 ROW_CON.8
SHFT_CLK  (via drill 0.61)
  Top 0.254: v25.4,16.05 v25.4,8.74 | U$1.2 15.85,20.32 15.85,17.88 U$1.4 | 5168_G.3 26.82,49.58 27.84,50.6 27.84,63.2 26.82,64.21 26.82,64.62 5168_B.3 | v55.68,61.77 55.68,53.44 59.54,49.58 5168_R.3 | v23.37,17.48 23.37,25.2 22.55,26.01 22.55,33.33 21.74,34.14 21.34,34.14 20.73,33.53 19.3,33.53 19.3,34.14 19.1,34.34 v19.1,49.17
  Bottom 0.254: U$1.2 15.44,20.32 14.02,21.74 12.8,21.74 7.72,16.66 CTL_IN.12 | v25.4,8.74 28.65,8.74 29.06,8.33 SHIFT_A.11 | v25.4,16.05 24.18,17.27 23.37,17.27 | 23.37,17.27 16.46,17.27 16.05,17.68 U$1.4 | v55.68,61.77 54.66,62.79 28.65,62.79 5168_B.3 | v23.37,17.48 23.37,17.27 | v19.1,49.17 21.13,51.21 24.99,51.21 5168_G.3
SHFT_CLK_BUFFERED  (via drill 0.61)
  Top 0.254: v49.58,33.12 54.25,28.45 54.25,26.82 53.44,26.01 53.44,4.47 52.22,3.25 IC1.3 | v12.6,37.59 12.19,37.19 12.19,21.13 11.99,20.93 11.99,19.1 13.21,17.88 U$1.3
  Bottom 0.254: v49.58,33.12 49.17,33.53 40.03,33.53 35.97,37.59 v12.6,37.59
SHFT_CLK_IN  (via drill 0.61)
  Top 0.254: v31.9,19.51 31.9,1.42 47.75,1.42 49.38,3.05 IC1.2 | v15.04,21.95 13.41,20.32 U$1.1
  Bottom 0.254: v31.9,19.51 31.5,19.91 26.21,19.91 25.6,20.52 23.37,20.52 22.76,19.91 18.09,19.91 16.05,21.95 v15.04,21.95 | CTL_IN.11 5.08,16.46 6.3,15.24 8.33,15.24 13.41,20.32 U$1.1
SHFT_DATA_IN  (via drill 0.61)
  Top 0.254: v52.43,36.37 52.43,35.97 63.4,24.99 63.4,6.3 60.35,6.3 57.3,3.25 IC1.5 | v10.36,42.47 10.16,42.27 10.16,15.85 v9.96,15.65 | CTL_IN.13 5.08,14.02 7.52,14.02 CTL_IN.14
  Bottom 0.254: v52.43,36.37 46.94,41.86 27.03,41.86 26.42,42.47 v10.36,42.47 | CTL_IN.14 7.72,14.02 8.33,14.02 v9.96,15.65 12.8,15.65 13.21,15.24 U$1.5
SHFT_DATA_IN_BUFFERED  (via drill 0.61)
  Top 0.254: v36.98,12.19 36.58,12.6 36.58,29.67 31.7,34.54 31.7,37.59 29.67,39.62 28.45,39.62 v28.45,23.98 | v9.14,22.76 8.94,22.55 8.94,15.24 11.38,12.8 13.21,12.8 U$1.7
  Bottom 0.254: v36.98,12.19 42.06,7.11 49.38,7.11 50.19,7.92 56.9,7.92 59.54,5.28 59.54,3.25 IC1.6 | v28.45,23.98 28.04,23.57 9.96,23.57 v9.14,22.76
SHFT_DATA_OUT
  Top 0.254: CTL_IN.5 5.08,24.18 7.52,24.18 CTL_IN.6 7.72,24.18 8.94,25.4 8.94,39.22 5.08,43.08 JP1.4
  Bottom 0.254: JP1.4 5.08,48.16 10.16,53.24 49.17,53.24 49.58,53.65 56.08,53.65 59.54,57.1 5168_R.14

### Text on the board
tPlace: A0 | A1 | 5168_B | A2 | B_TRIM | A3 | A4 | A5 | A6 | A7 | 5168_G | 5168_R | 5V | G_TRIM | R_TRIM | GND | RJMP | RJMP | S | D | G | S | D | G | S | D | G | S | D | G | S | D | G | S | D | G | CJMP | GND | DO | CLR | CLK | 10k | LCH | B | CLK | DIN | DIN | 100 | B | B | 5V | LCH | S | D | G | S | D | G | B | 595_ROW | BUFFER | CLR | B | v2.0